# Altium project Fri3d_2024_Exp0_01.PrjPcb
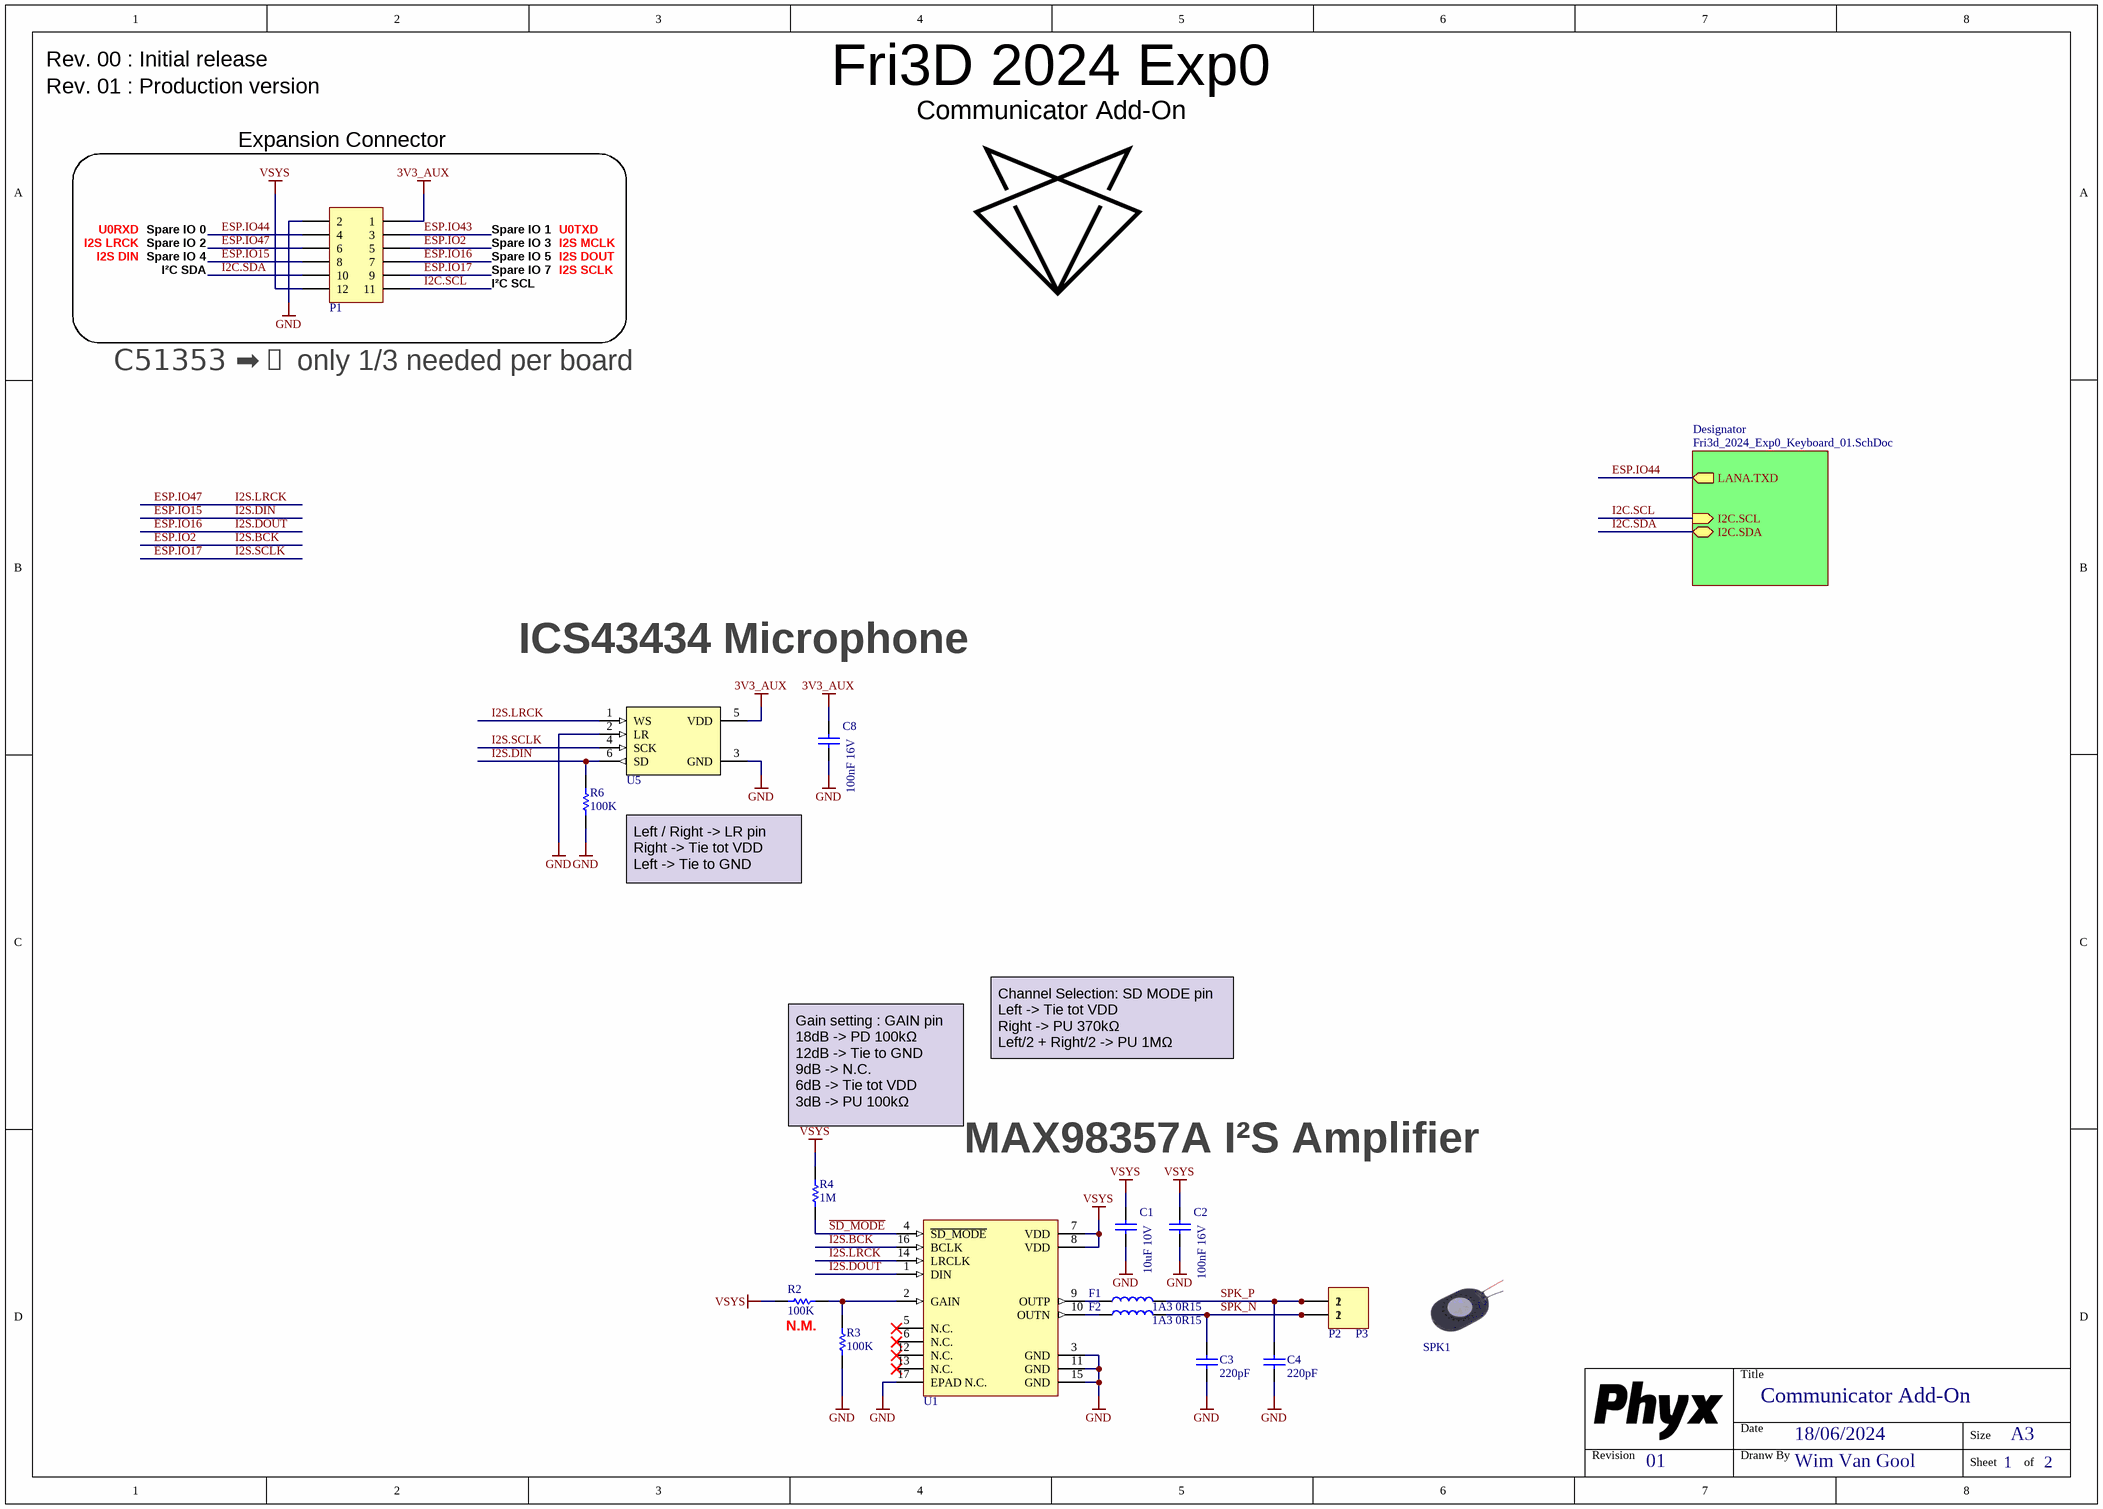
[diagram p0: Fri3d_2024_Exp0_01.SchDoc]
PCB_ENGINEER: WimVG; PCB_REV: 01; PCB_TITLE: Fri3D 2024 Exp0
2 sheets, 37 parts. Net scope: hierarchical (ports join the sheet entries above them; power ports are global).
Board file: Fri3d_2024_Exp0_01.PcbDoc
Sheets:
  Fri3d_2024_Exp0_01.SchDoc
    Designator = Fri3d_2024_Exp0_Keyboard_01.SchDoc

## Sheet Fri3d_2024_Exp0_01.SchDoc: Communicator Add-On
size A3; Date: 18/06/2024; DrawnBy: Wim Van Gool; DocumentNumber: 1; Revision: 01; SheetNumber: 1; SheetTotal: 2

### Parts
C1  value 10uF 10V  [C0805_N]  (hidden comment: CAP_CERAMIC)
C2  value 100nF 16V  [C0603_N]
C3  value 220pF  [C0603_N]  (hidden comment: CAP_CERAMIC)
C4  value 220pF  [C0603_N]  (hidden comment: CAP_CERAMIC)
C8  value 100nF 16V  [C0603_N]
F1  value 1A3 0R15  [L0603]  (hidden comment: BLM18KG601SN1D)
F2  value 1A3 0R15  [L0603]  (hidden comment: BLM18KG601SN1D)
P1  Header 6X2  [HDR2X6]  (value not drawn)
P2  Header 2.0mm Shrouded 2  [WE_620102131822]  (value not drawn)
P3  Header 2 RA  [HDR1X2_RA]  (value not drawn)
R2  value 100K  [R0603_N]  (hidden comment: RESISTOR)
R3  value 100K  [R0603_N]  (hidden comment: RESISTOR)
R4  value 1M  [R0603_N]  (hidden comment: RESISTOR)
R6  value 100K  [R0603_N]  (hidden comment: RESISTOR)
SPK1  INGHAi GSPK3020035PN 8R 1W 100mm Leads  (value not drawn)
U1  Mono I²S DAC AMP 3W 2.5~5.5V  [QFN_16_0.5_3X3]  (value not drawn)
U5  I2S MIC ICS-43434  [TDK_ICS-43434]  (value not drawn)

### Blocks framed on the sheet
C51353 ➡️ only 1/3 needed per board: P1

### Sub-sheets
Designator = Fri3d_2024_Exp0_Keyboard_01.SchDoc: LANA.TXD (out), I2C.SCL (in), I2C.SDA (bidir)

### Nets
3V3_AUX: C8.1 P1.1 U5.5(VDD)
GND: C1.2 C2.2 C3.2 C4.2 C8.2 P1.2 R3.2 R6.2 U1.3(GND) U1.11(GND) U1.15(GND) U1.17(EPAD_N.C.) U5.2(LR) U5.3(GND)
VSYS: C1.1 C2.1 P1.12 R2.2 R4.1 U1.7(VDD) U1.8(VDD)
ESP.IO2: P1.5 U1.16(BCLK)  [also labelled I2S.BCK]
ESP.IO15: P1.8 R6.1 U5.6(SD)  [also labelled I2S.DIN]
ESP.IO16: P1.7 U1.1(DIN)  [also labelled I2S.DOUT]
ESP.IO17: P1.9 U5.4(SCK)  [also labelled I2S.SCLK]
ESP.IO43: P1.3
ESP.IO44: P1.4 ; sheet Designator/LANA.TXD
ESP.IO47: P1.6 U1.14(LRCLK) U5.1(WS)  [also labelled I2S.LRCK]
I2C.SCL: P1.11 ; sheet Designator/I2C.SCL
I2C.SDA: P1.10 ; sheet Designator/I2C.SDA
~{SD_MODE}: R4.2 U1.4(~{SD_MODE})
SPK_N: C3.1 F2.2 P2.2 P3.1
SPK_P: C4.1 F1.2 P2.1 P3.2
NetF1_1: F1.1 U1.9(OUTP)
NetF2_1: F2.1 U1.10(OUTN)
NetR2_1: R2.1 R3.1 U1.2(GAIN)

Not connected (* = marked no-connect by the designer): U1 5(N.C.)* 6(N.C.)* 12(N.C.)* 13(N.C.)*

### Notes on the sheet
- Rev. 00 : Initial release
- Rev. 01 : Production version
- Expansion Connector
- I2S LRCK
- I2S DIN
- U0RXD
- Spare IO 0
- Spare IO 2
- Spare IO 4
- Spare IO 1
- Spare IO 3
- Spare IO 5
- I2S MCLK
- I2S DOUT
- U0TXD
- I²C SDA
- I²C SCL
- Spare IO 7
- I2S SCLK
- ICS43434 Microphone
- Left / Right -> LR pin
  Right -> Tie tot VDD
  Left -> Tie to GND
- Channel Selection: SD MODE pin
  Left -> Tie tot VDD
  Right -> PU 370kΩ
  Left/2 + Right/2 -> PU 1MΩ
- Gain setting : GAIN pin
  18dB -> PD 100kΩ
  12dB -> Tie to GND
  9dB -> N.C.
  6dB -> Tie tot VDD
  3dB -> PU 100kΩ
- MAX98357A I²S Amplifier
- (near R2) N.M.
- Title
- Revision
- Date
- Dranw By
- Size
- A3
- Sheet
- of

### Library data of the parts
C1 = CAP # 10uF 10V 0805: Capacitor Ceramic; Supplier 1: Farnell; Supplier Part Number 1: 2320859
C2 C8 = CAP # 100nF 16V 0603: Capacitor Ceramic
C3 C4 = CAP # 220pF 50V 0603: Capacitor Ceramic; Supplier 1: LCSC; Supplier Part Number 1: C5254623; Supplier 2: LCSC; Supplier Part Number 2: C107081; Supplier 3: Generic; Supplier Part Number 3: 220pF 0603
F1 F2 = FER # 600R 1A3 0603 0R15 BLM18KG601SN1D: Supplier 1: Farnell; Supplier Part Number 1: 1781094
P1 = Pin Header 2.54mm dual row 12way
P2 = HDR # SHR 2.0mm 2way - 620102131822: Value: 620102131822; Supplier 1: Wurth; Supplier Part Number 1: 620102131822; Supplier 2: Mouser; Supplier Part Number 2: 710-620102131822
P3 = Pin Header 2.54mm 2way RA
R2 R3 R6 = RES # 100K 0603: Supplier 3: Generic; Supplier Part Number 3: 100K 1% 0603
R4 = RES # 1M 0603: Supplier 3: Generic; Supplier Part Number 3: 1M 1% 0603
SPK1 = SPEAKER 8R 1W 10cm: Value: GSPK3020035PN-8R1.0W-L100; Description: SPEAKER 8R 1W 10cm; Supplier 1: LCSC; Supplier Part Number 1: C530556
U1 = AMP # AUD MAX98357A: =Description; Value: MAX98357A; Supplier 1: Farnell; Supplier Part Number 1: 2949165
U5 = MIC # MEMS I2S ICS-43434: =Description; Value: ICS-43434; Supplier 1: Mouser; Supplier Part Number 1: 410-ICS-43434; Supplier 2: Farnell; Supplier Part Number 2: 2911502

## Sheet Fri3d_2024_Exp0_Keyboard_01.SchDoc: Keyboard
size A3; Date: 18/06/2024; DrawnBy: Wim Van Gool; DocumentNumber: 2; Revision: 01; SheetNumber: 2; SheetTotal: 2
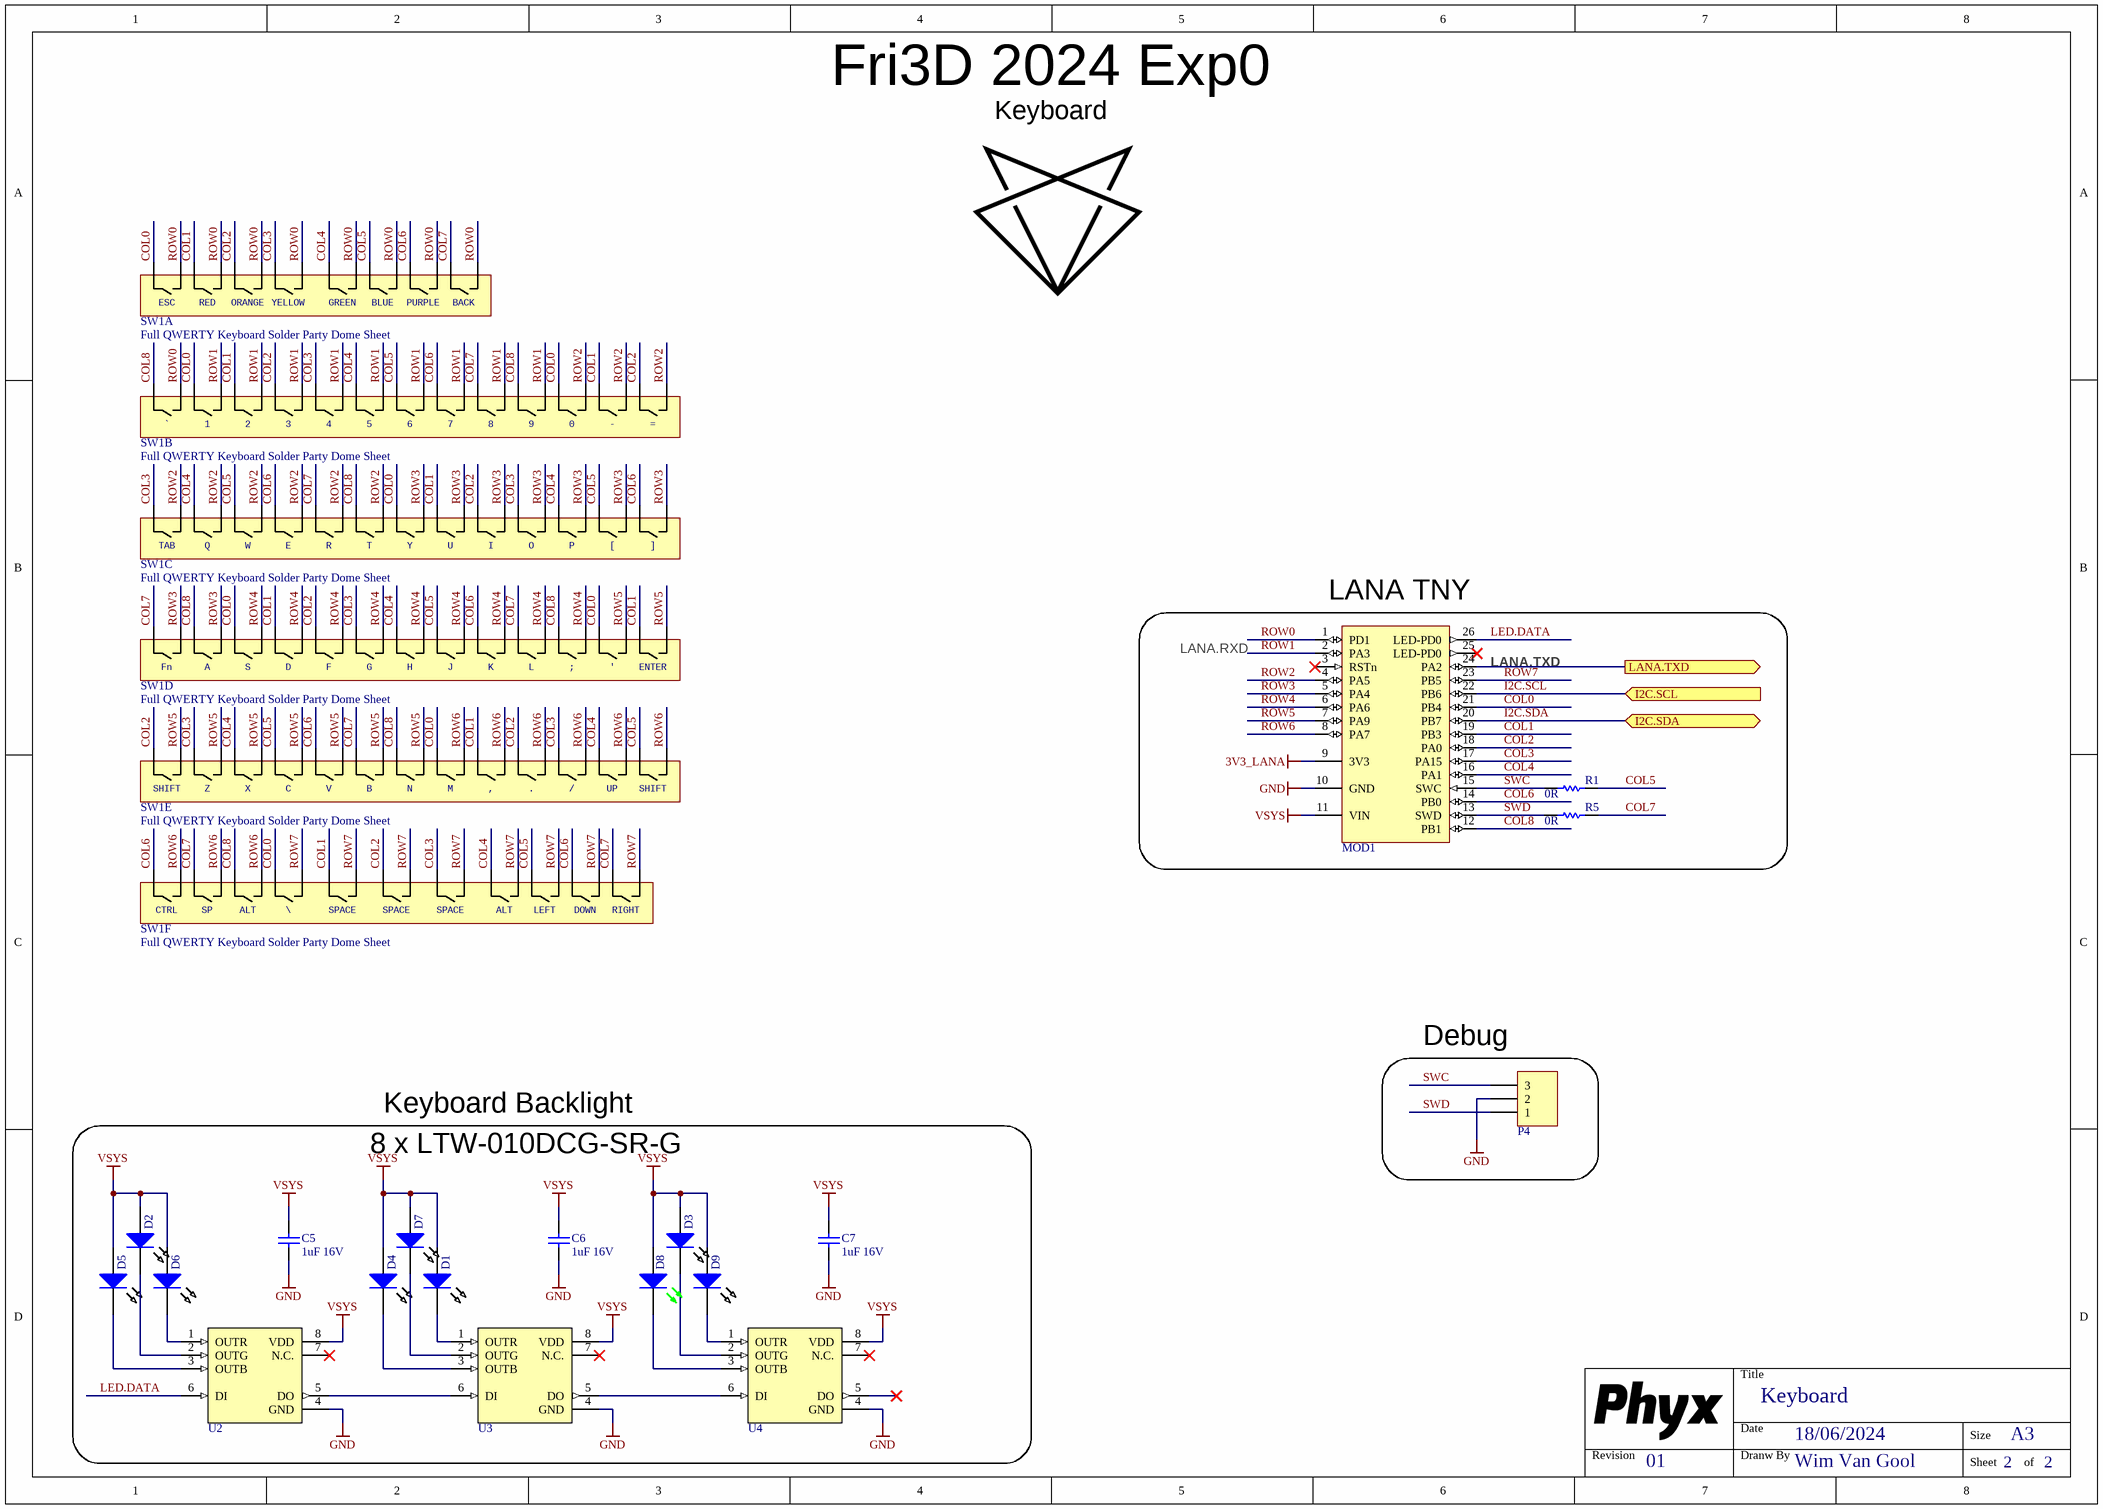
[diagram p1: Fri3d_2024_Exp0_Keyboard_01.SchDoc]

### Parts
C5  value 1uF 16V  [C0603_N]  (hidden comment: CAP_CERAMIC)
C6  value 1uF 16V  [C0603_N]  (hidden comment: CAP_CERAMIC)
C7  value 1uF 16V  [C0603_N]  (hidden comment: CAP_CERAMIC)
D1  Side emitting Cool White LED 3.0V 30mA 120° 2900mcd  [LITE_LTW-010DCG]  (value not drawn)
D2  Side emitting Cool White LED 3.0V 30mA 120° 2900mcd  [LITE_LTW-010DCG]  (value not drawn)
D3  Side emitting Cool White LED 3.0V 30mA 120° 2900mcd  [LITE_LTW-010DCG]  (value not drawn)
D4  Side emitting Cool White LED 3.0V 30mA 120° 2900mcd  [LITE_LTW-010DCG]  (value not drawn)
D5  Side emitting Cool White LED 3.0V 30mA 120° 2900mcd  [LITE_LTW-010DCG]  (value not drawn)
D6  Side emitting Cool White LED 3.0V 30mA 120° 2900mcd  [LITE_LTW-010DCG]  (value not drawn)
D7  Side emitting Cool White LED 3.0V 30mA 120° 2900mcd  [LITE_LTW-010DCG]  (value not drawn)
D8  Default 0805 Green LED  [LED_0805_GR]  (value not drawn)
D9  Side emitting Cool White LED 3.0V 30mA 120° 2900mcd  [LITE_LTW-010DCG]  (value not drawn)
MOD1  CH23V203 based TNY module  [PHYX_LANA_TNY_SMD]  (value not drawn)
P4  Header 3  [HDR1X3]  (value not drawn)
R1  value 0R  [R0603_N]  (hidden comment: RESISTOR)
R5  value 0R  [R0603_N]  (hidden comment: RESISTOR)
SW1  Full QWERTY Keyboard Solder Party Dome Sheet  [Solder_Party_Keyb]  (parts A,B,C,D,E,F of 6)
U2  3 Channel CC LED Driver 20mA  [WS_FSOP-8]  (value not drawn)
U3  3 Channel CC LED Driver 20mA  [WS_FSOP-8]  (value not drawn)
U4  3 Channel CC LED Driver 20mA  [WS_FSOP-8]  (value not drawn)

### Blocks framed on the sheet
8 x LTW-010DCG-SR-G: C5-C7 D1-D9 U2-U4

### Ports
I2C.SCL (in), I2C.SDA (bidir), LANA.TXD (out)

### Nets
3V3_LANA: MOD1.9(3V3)
GND: C5.2 C6.2 C7.2 MOD1.10(GND) P4.2 U2.4(GND) U3.4(GND) U4.4(GND)
VSYS: C5.1 C6.1 C7.1 D1.1(A) D2.1(A) D3.1(A) D4.1(A) D5.1(A) D6.1(A) D7.1(A) D8.1(A) D9.1(A) MOD1.11(VIN) U2.8(VDD) U3.8(VDD) U4.8(VDD)
COL0: MOD1.21(PB4) SW1.1 SW1.19 SW1.37 SW1.55 SW1.73 SW1.91 SW1.109 SW1.127
COL1: MOD1.19(PB3) SW1.3 SW1.21 SW1.39 SW1.57 SW1.75 SW1.93 SW1.111 SW1.129
COL2: MOD1.18(PA0) SW1.5 SW1.23 SW1.41 SW1.59 SW1.77 SW1.95 SW1.113 SW1.131
COL3: MOD1.17(PA15) SW1.7 SW1.25 SW1.43 SW1.61 SW1.79 SW1.97 SW1.115 SW1.133
COL4: MOD1.16(PA1) SW1.9 SW1.27 SW1.45 SW1.63 SW1.81 SW1.99 SW1.117 SW1.135
COL5: R1.1 SW1.11 SW1.29 SW1.47 SW1.65 SW1.83 SW1.101 SW1.119 SW1.137
COL6: MOD1.14(PB0) SW1.13 SW1.31 SW1.49 SW1.67 SW1.85 SW1.103 SW1.121 SW1.139
COL7: R5.1 SW1.15 SW1.33 SW1.51 SW1.69 SW1.87 SW1.105 SW1.123 SW1.141
COL8: MOD1.12(PB1) SW1.17 SW1.35 SW1.53 SW1.71 SW1.89 SW1.107 SW1.125
ESP.IO44: MOD1.24(PA2) ; port LANA.TXD
I2C.SCL: MOD1.22(PB6) ; port I2C.SCL
I2C.SDA: MOD1.20(PB7) ; port I2C.SDA
LED.DATA: MOD1.26(LED-PD0) U2.6(DI)
ROW0: MOD1.1(PD1) SW1.2 SW1.4 SW1.6 SW1.8 SW1.10 SW1.12 SW1.14 SW1.16 SW1.18
ROW1: MOD1.2(PA3) SW1.20 SW1.22 SW1.24 SW1.26 SW1.28 SW1.30 SW1.32 SW1.34 SW1.36
ROW2: MOD1.4(PA5) SW1.38 SW1.40 SW1.42 SW1.44 SW1.46 SW1.48 SW1.50 SW1.52 SW1.54
ROW3: MOD1.5(PA4) SW1.56 SW1.58 SW1.60 SW1.62 SW1.64 SW1.66 SW1.68 SW1.70 SW1.72
ROW4: MOD1.6(PA6) SW1.74 SW1.76 SW1.78 SW1.80 SW1.82 SW1.84 SW1.86 SW1.88 SW1.90
ROW5: MOD1.7(PA9) SW1.92 SW1.94 SW1.96 SW1.98 SW1.100 SW1.102 SW1.104 SW1.106 SW1.108
ROW6: MOD1.8(PA7) SW1.110 SW1.112 SW1.114 SW1.116 SW1.118 SW1.120 SW1.122 SW1.124 SW1.126
ROW7: MOD1.23(PB5) SW1.128 SW1.130 SW1.132 SW1.134 SW1.136 SW1.138 SW1.140 SW1.142
SWC: MOD1.15(SWC) P4.3 R1.2
SWD: MOD1.13(SWD) P4.1 R5.2
NetD1_2: D1.2(K) U3.1(OUTR)
NetD2_2: D2.2(K) U2.2(OUTG)
NetD3_2: D3.2(K) U4.2(OUTG)
NetD4_2: D4.2(K) U3.3(OUTB)
NetD5_2: D5.2(K) U2.3(OUTB)
NetD6_2: D6.2(K) U2.1(OUTR)
NetD7_2: D7.2(K) U3.2(OUTG)
NetD8_2: D8.2(K) U4.3(OUTB)
NetD9_2: D9.2(K) U4.1(OUTR)
NetU2_5: U2.5(DO) U3.6(DI)
NetU3_5: U3.5(DO) U4.6(DI)

Not connected (* = marked no-connect by the designer): MOD1 3(RSTn)* 25(LED-PD0)*; U2 7(N.C.)*; U3 7(N.C.)*; U4 5(DO)* 7(N.C.)*

### Notes on the sheet
- (near MOD1) LANA TNY
- LANA.RXD
- (near MOD1) LANA.TXD
- (near P4) Debug
- Keyboard Backlight
- Title
- Revision
- Date
- Dranw By
- Size
- A3
- Sheet
- of
- (in symbol Solder_Party_Keyb, part A) ESC; RED; ORANGE; YELLOW; GREEN; BLUE; PURPLE; BACK
- (in symbol Solder_Party_Keyb, part B) `; 0; -
- (in symbol Solder_Party_Keyb, part C) TAB; Q; W; E; R; T; Y; U; I; O; P; [; ]
- (in symbol Solder_Party_Keyb, part D) Fn; A; S; D; F; G; H; J; K; L; ;; '; ENTER
- (in symbol Solder_Party_Keyb, part E) SHIFT; Z; X; C; V; B; N; M; ,; .; /; UP
- (in symbol Solder_Party_Keyb, part F) CTRL; SP; ALT; \; SPACE; LEFT; DOWN; RIGHT

### Library data of the parts
C5-C7 = CAP # 1uF 16V 0603: Capacitor Ceramic; Supplier 1: Farnell; Supplier Part Number 1: 2320814; Supplier 2: LCSC; Supplier Part Number 2: C1592; Supplier 3: Generic; Supplier Part Number 3: 1uF 16V 0603 X7R
D1-D7 D9 = LED # White Side Emitting LTW-010DCG-SR-G: =Description; Value: LTW-010DCG-SR-G; Supplier 1: LCSC; Supplier Part Number 1: C5175311; Supplier 2: LCSC; Supplier Part Number 2: C5175309; Supplier 3: LCSC; Supplier Part Number 3: C5175310
D8 = LED # Green 0805: =Description; Supplier 1: Farnell; Supplier Part Number 1: 2099239; Supplier 2: LCSC; Supplier Part Number 2: C965815
MOD1 = MOD # CH23V203 LANA TNY SMD: Value: LANA TNY; Supplier 1: Phyx; Supplier Part Number 1: LANA TNY
P4 = Pin Header 2.54mm 3way: Supplier 1: LCSC; Supplier Part Number 1: C429954; Supplier 2: LCSC; Supplier Part Number 2: C49257
R1 R5 = RES # 0R 0603: Supplier 1: Farnell; Supplier Part Number 1: 2447743; Supplier 2: LCSC; Supplier Part Number 2: C95177; Supplier 3: Generic; Supplier Part Number 3: 0R 1% 0603
SW1 = Solder_Party_Keyb
U2-U4 = LED_DRVR # WS2811F FSOP-8: WS2811F 3-Ch LED Driver; Value: WS2811F; Supplier 1: LCSC; Supplier Part Number 1: C5446692

## Nets that join several sheets
GND: Fri3d_2024_Exp0_01 (14 pins), Fri3d_2024_Exp0_Keyboard_01 (8 pins)
VSYS: Fri3d_2024_Exp0_01 (7 pins), Fri3d_2024_Exp0_Keyboard_01 (16 pins)
ESP.IO44: Fri3d_2024_Exp0_01 (P1.4), Fri3d_2024_Exp0_Keyboard_01 (MOD1.24)
I2C.SCL: Fri3d_2024_Exp0_01 (P1.11), Fri3d_2024_Exp0_Keyboard_01 (MOD1.22)
I2C.SDA: Fri3d_2024_Exp0_01 (P1.10), Fri3d_2024_Exp0_Keyboard_01 (MOD1.20)

## Assembly variants
Default: not fitted C1 C3 D6 D10 D14 J1 MOD2 P2 P3 P4 P4 P5 P6 P8 P9 R2 R3 R4 R18 R19 R28 R31 R32 R34 R44 R47 T4 U2 U3